# EAGLE design ping_clock_mounting_pcb (EAGLE 6.4)
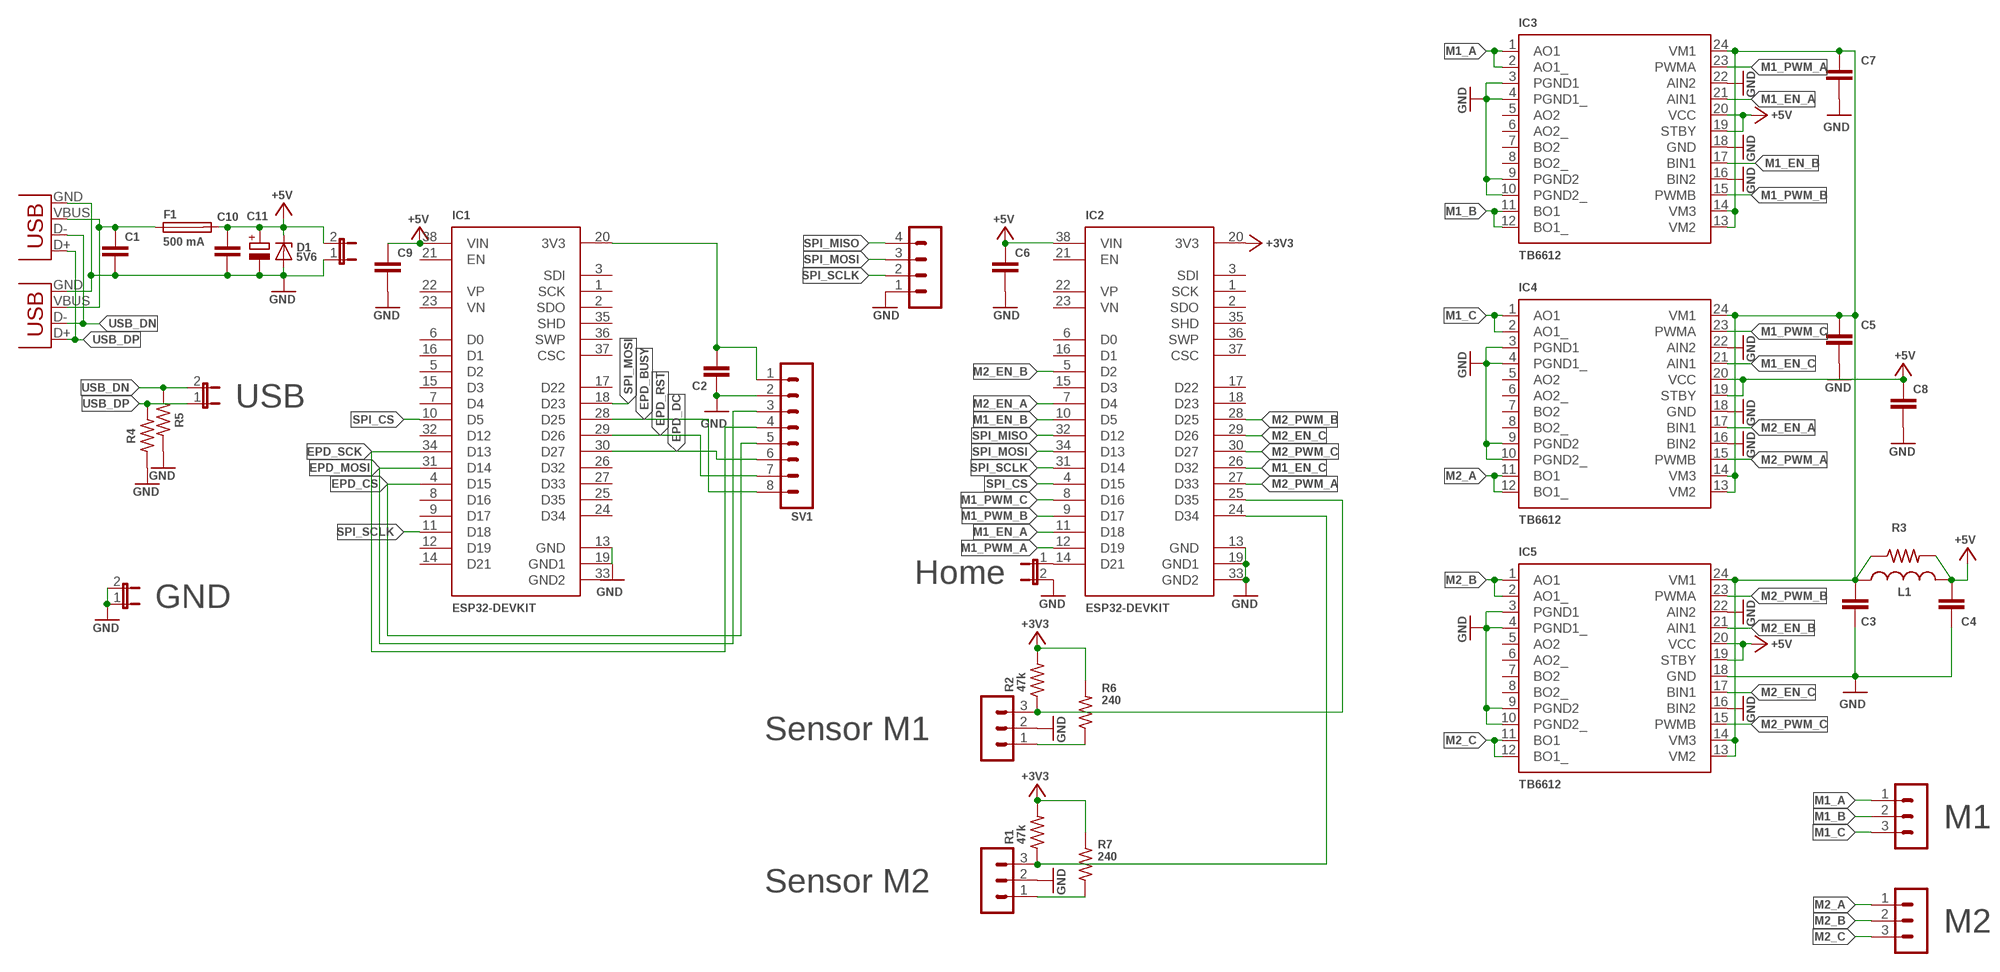
[diagram p0: schematic, sheet 1]

## Parts
C1  C-EUC1206  [C1206]
C2  C-EUC1206  [C1206]
C3  C-EUC1206  [C1206]
C4  C-EUC1206  [C1206]
C5  C-EUC1206  [C1206]
C6  C-EUC1206  [C1206]
C7  C-EUC1206  [C1206]
C8  C-EUC1206  [C1206]
C9  C-EUC1206  [C1206]
C10  C-EUC1206  [C1206]
C11  CPOL-EUD/7343-31R  [D/7343-31R]
D1  5V6  ZENER-DIODEDO41Z10  [DO41Z10]
F1  500 mA  FUSESHK20L  [SHK20L]
IC1  ESP32-DEVKIT  ESP32-DEVKIT-V1  [MODULE_ESP32_DEVKIT_V1]
IC2  ESP32-DEVKIT  ESP32-DEVKIT-V1  [MODULE_ESP32_DEVKIT_V1]
IC3  TB6612  [SSOP24]
IC4  TB6612  [SSOP24]
IC5  TB6612  [SSOP24]
JP1  JP1E  [JP1]
JP3  JP1E  [JP1]
JP4  JP1E  [JP1]
JP5  JP1E  [JP1]
L1  L-USL3225P  [L3225P]
R1  47k  R-US_R1206  [R1206]
R2  47k  R-US_R1206  [R1206]
R3  R-US_R1206  [R1206]
R4  R-US_R1206  [R1206]
R5  R-US_R1206  [R1206]
R6  240  R-US_R1206  [R1206]
R7  240  R-US_R1206  [R1206]
SV1  MA08-1  [MA08-1]
SV2  MA03-1  [MA03-1]
SV3  MA03-1  [MA03-1]
SV4  MA03-1  [MA03-1]
SV5  MA03-1  [MA03-1]
SV6  MA04-1  [MA04-1]
X1  USBSMD  [USB-MINIB]
X2  USBPTH  [USB-B-PTH]

## Nets
+3V3: IC2.20(3V3) R1.2 R2.2 R6.2 R7.2
+5V: C4.1 C6.1 C8.1 C9.1 C10.1 C11.+ D1.C F1.2A IC1.38(VIN) IC2.38(VIN) IC3.19(STBY) IC3.20(VCC) IC4.19(STBY) IC4.20(VCC) IC5.19(STBY) IC5.20(VCC) JP5.2 L1.2 R3.2
EPD_BUSY: IC1.28(D25) SV1.8
EPD_CS: IC1.4(D15) SV1.5
EPD_DC: IC1.30(D27) SV1.6
EPD_MOSI: IC1.31(D14) SV1.3
EPD_RST: IC1.29(D26) SV1.7
EPD_SCK: IC1.34(D13) SV1.4
GND: C1.2 C2.1 C3.2 C4.2 C5.2 C6.2 C7.2 C8.2 C9.2 C10.2 C11.- D1.A IC1.13(GND) IC2.13(GND) IC2.19(GND1) IC2.33(GND2) IC3.3(PGND1) IC3.4(PGND1_) IC3.9(PGND2) IC3.10(PGND2_) IC3.16(BIN2) IC3.18(GND) IC3.22(AIN2) IC4.3(PGND1) IC4.4(PGND1_) IC4.9(PGND2) IC4.10(PGND2_) IC4.16(BIN2) IC4.18(GND) IC4.22(AIN2) IC5.3(PGND1) IC5.4(PGND1_) IC5.9(PGND2) IC5.10(PGND2_) IC5.16(BIN2) IC5.18(GND) IC5.22(AIN2) JP1.1 JP1.2 JP4.2 JP5.1 R4.1 R5.1 SV1.2 SV4.2 SV5.2 SV6.1 X1.GND X2.GND
M1_A: IC3.1(AO1) IC3.2(AO1_) SV2.1
M1_B: IC3.11(BO1) IC3.12(BO1_) SV2.2
M1_C: IC4.1(AO1) IC4.2(AO1_) SV2.3
M1_EN_A: IC2.11(D18) IC3.21(AIN1)
M1_EN_B: IC2.10(D5) IC3.17(BIN1)
M1_EN_C: IC2.26(D32) IC4.21(AIN1)
M1_PWM_A: IC2.12(D19) IC3.23(PWMA)
M1_PWM_B: IC2.9(D17) IC3.15(PWMB)
M1_PWM_C: IC2.8(D16) IC4.23(PWMA)
M2_A: IC4.11(BO1) IC4.12(BO1_) SV3.1
M2_B: IC5.1(AO1) IC5.2(AO1_) SV3.2
M2_C: IC5.11(BO1) IC5.12(BO1_) SV3.3
M2_EN_A: IC2.7(D4) IC4.17(BIN1)
M2_EN_B: IC2.5(D2) IC5.21(AIN1)
M2_EN_C: IC2.29(D26) IC5.17(BIN1)
M2_PWM_A: IC2.27(D33) IC4.15(PWMB)
M2_PWM_B: IC2.28(D25) IC5.23(PWMA)
M2_PWM_C: IC2.30(D27) IC5.15(PWMB)
N$1: IC2.14(D21) JP4.1
N$2: C2.2 IC1.20(3V3) SV1.1
N$3: C1.1 F1.1A X1.VBUS X2.VBUS
N$4: R6.1 SV4.1
N$5: IC2.24(D34) R1.1 SV5.3
N$6: R7.1 SV5.1
N$8: IC2.25(D35) R2.1 SV4.3
N$11: C3.1 C5.1 C7.1 IC3.13(VM2) IC3.14(VM3) IC3.24(VM1) IC4.13(VM2) IC4.14(VM3) IC4.24(VM1) IC5.13(VM2) IC5.14(VM3) IC5.24(VM1) L1.1 R3.1
SPI_CS: IC1.10(D5) IC2.4(D15)
SPI_MISO: IC2.32(D12) SV6.4
SPI_MOSI: IC1.18(D23) IC2.34(D13) SV6.3
SPI_SCLK: IC1.11(D18) IC2.31(D14) SV6.2
USB_DN: JP3.2 R5.2 X1.D- X2.D-
USB_DP: JP3.1 R4.2 X1.D+ X2.D+
Unconnected: IC1.1(SCK) IC1.2(SDO) IC1.3(SDI) IC1.5(D2) IC1.6(D0) IC1.7(D4) IC1.8(D16) IC1.9(D17) IC1.12(D19) IC1.14(D21) IC1.15(D3) IC1.16(D1) IC1.17(D22) IC1.21(EN) IC1.22(VP) IC1.23(VN) IC1.24(D34) IC1.25(D35) IC1.26(D32) IC1.27(D33) IC1.32(D12) IC1.35(SHD) IC1.36(SWP) IC1.37(CSC) IC2.1(SCK) IC2.2(SDO) IC2.3(SDI) IC2.6(D0) IC2.15(D3) IC2.16(D1) IC2.17(D22) IC2.18(D23) IC2.21(EN) IC2.22(VP) IC2.23(VN) IC2.35(SHD) IC2.36(SWP) IC2.37(CSC) IC3.5(AO2) IC3.6(AO2_) IC3.7(BO2) IC3.8(BO2_) IC4.5(AO2) IC4.6(AO2_) IC4.7(BO2) IC4.8(BO2_) IC5.5(AO2) IC5.6(AO2_) IC5.7(BO2) IC5.8(BO2_)

## Notes on the sheet
- USB
- Home
- GND
- Sensor M1
- M1
- Sensor M2
- M2

## Power pins joined to a net without a drawn wire
GND1: IC1.19(GND1)
GND2: IC1.33(GND2)

## Library data of the parts
C1-C10 = rcl:C-EU: CAPACITOR, European symbol
C11 = rcl:CPOL-EU: POLARIZED CAPACITOR, European symbol
D1 = diode:ZENER-DIODE: Z-Diode
F1 = fuse:FUSE: Fuse; OC_FARNELL: unknown; OC_NEWARK: unknown
IC1 IC2 = ESP32-DEVKIT-V1:ESP32-DEVKIT-V1: Dual core, Wi-Fi: 2.4 GHz up to 150 Mbits/s,BLE (Bluetooth Low Energy) and legacy Bluetooth, 32 bits, Up to 240 MHz Check prices <https://pricing.snapeda.com/parts/ESP32-DEVKIT-V1/Do%20it/view-part?ref=eda>; AVAILABILITY: Not in stock; DESCRIPTION: Dual core, Wi-Fi: 2.4 GHz up to 150 Mbits/s,BLE (Bluetooth Low Energy) and legacy Bluetooth, 32 bits, Up to 240 MHz; MF: Do it; MP: ESP32-DEVKIT-V1; PACKAGE: None; PRICE: None
IC3-IC5 = TB6612:TB6612: 8-bit Microcontroller with Multiprotocol Smart Card Interface Source: Uploaded by Heiko Künzel <heiko.kuenzel@atg-gera.de> from ATG Automatisierungstechnik Gera Mon Mar 10 13:32:48 2003 Atmel-Library mit zusätzlich T83C5121-Prozessor im SSOP24-Package.; OC_FARNELL: unknown; OC_NEWARK: unknown
JP1 JP3-JP5 = jumper:JP1E: JUMPER
L1 = rcl:L-US: INDUCTOR, American symbol
R1-R7 = rcl:R-US_: RESISTOR, American symbol
SV1 = con-lstb:MA08-1: PIN HEADER; OC_FARNELL: unknown; OC_NEWARK: unknown
SV2-SV5 = con-lstb:MA03-1: PIN HEADER; OC_FARNELL: unknown; OC_NEWARK: unknown
SV6 = con-lstb:MA04-1: PIN HEADER; OC_FARNELL: unknown; OC_NEWARK: unknown
X1 X2 = SparkFun:USB: USB Connectors USB-B-PTH is fully proven SKU : PRT-00139 USB-miniB is fully proven SKU : PRT-00587 USB-A-PCB is untested. USB-A-H is throughly reviewed, but untested. Spark Fun Electronics SKU : PRT-00437 USB-B-SMT is throughly reviewed, but untested. Needs silkscreen touching up. USB-A-S has not been used/tested USB-MB-H has not been used/tested

## Board
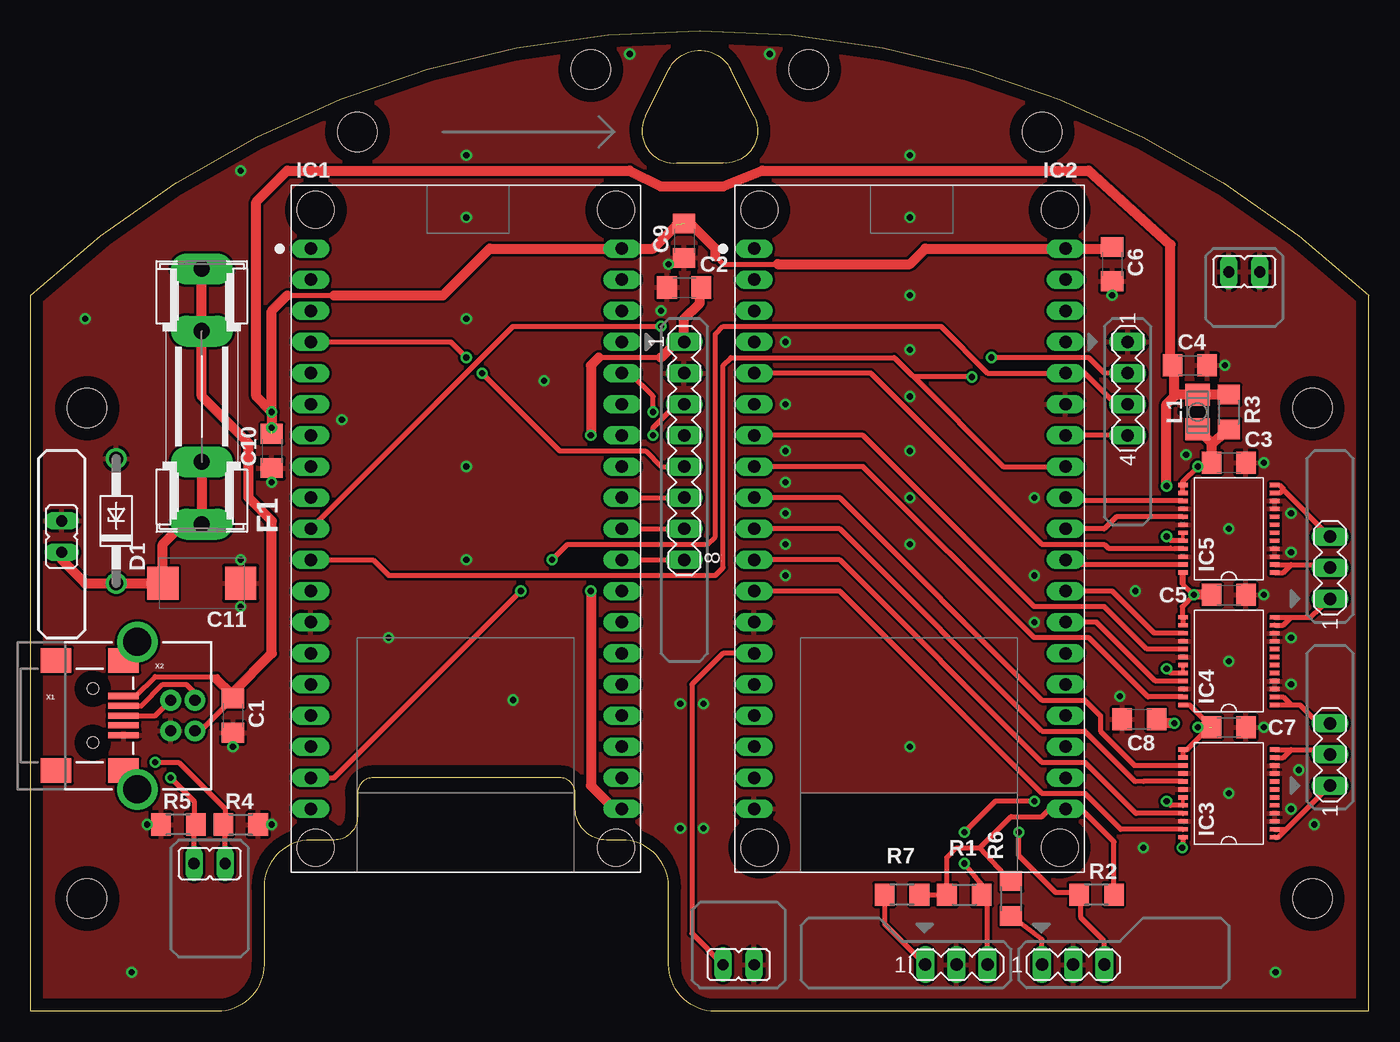
[diagram p1: board, top side]
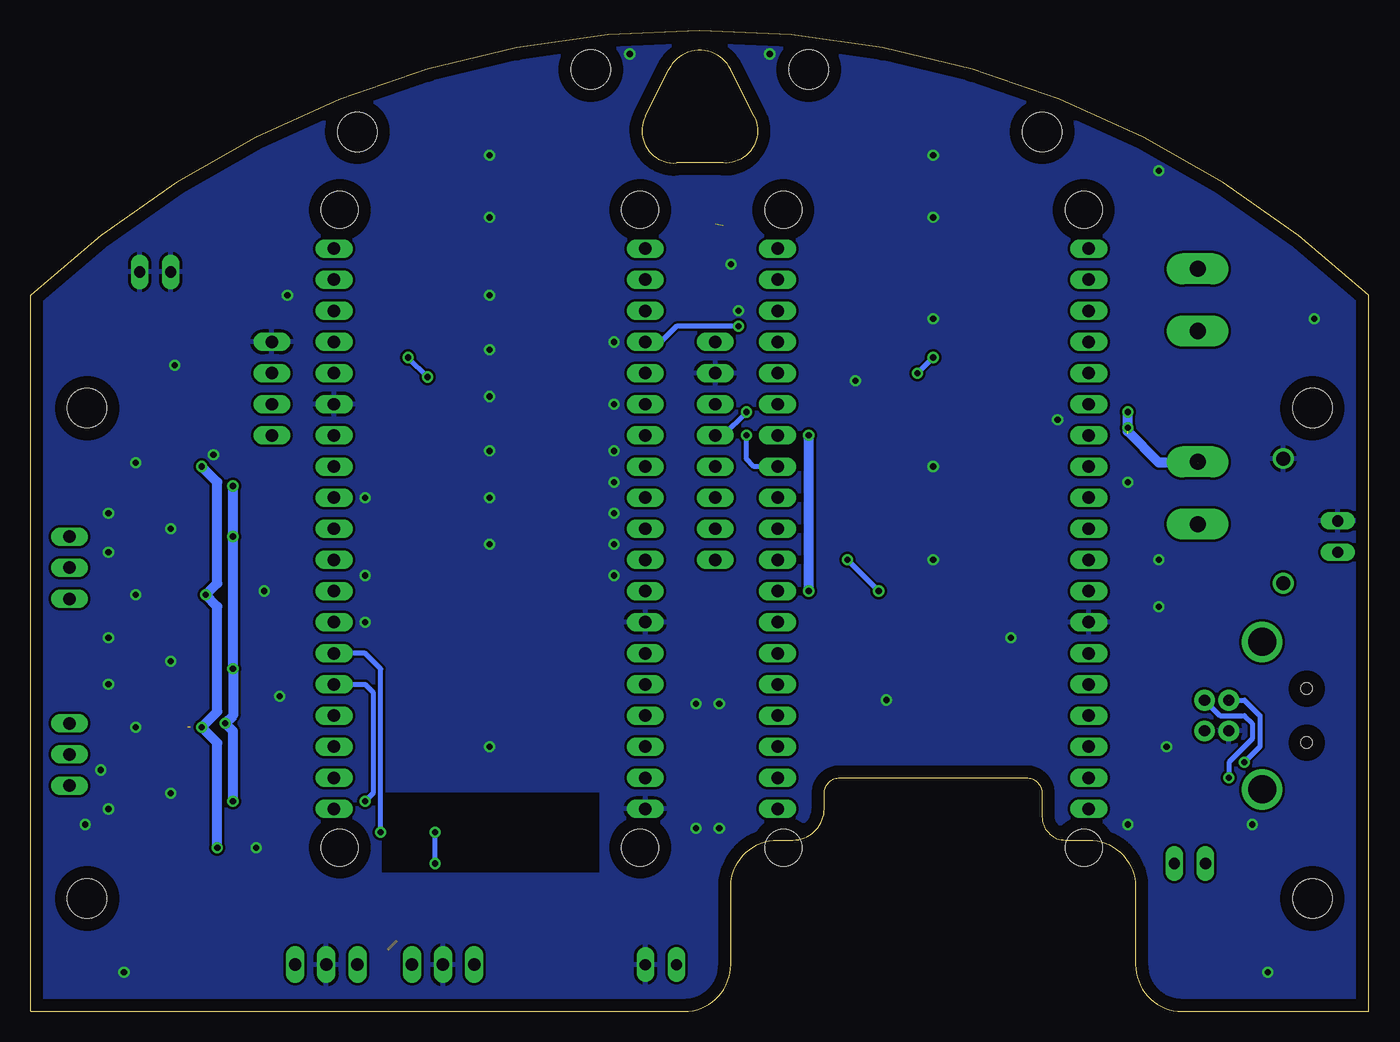
[diagram p2: board, bottom side, seen from below]

Size 109.22 x 80.01 mm. Coordinates in mm from the lower left corner, seen from the top.
Outline: 109.22,0 55.88,0 arc-90 52.07,3.81 52.07,10.16 arc90 48.26,13.97 46.99,13.97 arc-90 44.45,16.51 44.45,17.78 arc90 43.18,19.05 27.94,19.05 arc90 26.67,17.78 26.67,15.88 arc-90 24.77,13.97 22.86,13.97 arc90 19.05,10.16 19.05,3.81 arc-90 15.24,0 0,0 0,58.42 arc-86 109.22,58.42 109.22,0
Outline: 50.16,73.03 arc121 52.7,69.22 56.52,69.22 arc121 59.05,73.03 57.15,76.84 arc127 52.07,76.84 50.16,73.03
Copper layers (1*16): Top 0.035mm / dielectric 1.5mm / Bottom 0.035mm
Design rules "default": minimum track width 10mil, minimum drill 24mil, track to track 8mil, track to pad 8mil, pad to pad 8mil, via to via 8mil, smd to smd 8mil, copper to edge 40mil, drill to drill 8mil, minimum pad ring 10mil, minimum via ring 8mil, stop-mask expansion 4mil, vias tented up to drill 0mil, thermal gap 10mil
Holes 3.2 mm at 4.61,49.21 104.61,9.21 104.61,49.21 4.61,9.21 26.67,71.75 82.55,71.75 45.72,76.84 63.5,76.84
tRestrict: 1 lines

### Footprints (pad centres in the part's own frame; a part is rotated, then mirrored left to right if it is on the bottom)
C1206 = smd 1.6 x 1.8: 1 -1.4,0; 2 1.4,0
D/7343-31R = smd 2.55 x 2.7: + 3.175,0; - -3.175,0
DO41Z10 = drill 1.118: A 5.08,0; C -5.08,0
SHK20L = drill 1.321 pad 2.54 long: 1A -10.414,0; 1B -5.334,0; 2A 10.414,0; 2B 5.334,0
MODULE_ESP32_DEVKIT_V1 = drill 1.016 pad 1.422 long: 1 12.7,-20.32; 2 12.7,-17.78; 3 12.7,-15.24; 4 12.7,-12.7; 5 12.7,-10.16; 6 12.7,-7.62; 7 12.7,-5.08; 8 12.7,-2.54; 9 12.7,0; 10 12.7,2.54; 11 12.7,5.08; 12 12.7,7.62; 13 12.7,10.16; 14 12.7,12.7; 15 12.7,15.24; 16 12.7,17.78; 17 12.7,20.32; 18 12.7,22.86; 19 12.7,25.4; 20 -12.7,25.4; 21 -12.7,22.86; 22 -12.7,20.32; 23 -12.7,17.78; 24 -12.7,15.24; 25 -12.7,12.7; 26 -12.7,10.16; 27 -12.7,7.62; 28 -12.7,5.08; 29 -12.7,2.54; 30 -12.7,0; 31 -12.7,-2.54; 32 -12.7,-5.08; 33 -12.7,-7.62; 34 -12.7,-10.16; 35 -12.7,-12.7; 36 -12.7,-15.24; 37 -12.7,-17.78; 38 -12.7,-20.32 | hole 3: 12.28,28.555; -12.23,28.555; -12.23,-23.475; 12.28,-23.475
SSOP24 = smd 0.35 x 0.8: 1 -3.575,-3.735; 2 -2.925,-3.735; 3 -2.275,-3.735; 4 -1.625,-3.735; 5 -0.975,-3.735; 6 -0.325,-3.735; 7 0.325,-3.735; 8 0.975,-3.735; 9 1.625,-3.735; 10 2.275,-3.735; 11 2.925,-3.735; 12 3.575,-3.735; 13 3.575,3.735; 14 2.925,3.735; 15 2.275,3.735; 16 1.625,3.735; 17 0.975,3.735; 18 0.325,3.735; 19 -0.325,3.735; 20 -0.975,3.735; 21 -1.625,3.735; 22 -2.275,3.735; 23 -2.925,3.735; 24 -3.575,3.735
JP1 = drill 0.914 long: 1 0,-1.27; 2 0,1.27
L3225P = smd 1.8 x 2: 1 -1.4,0; 2 1.4,0
R1206 = smd 1.6 x 1.803: 1 -1.422,0; 2 1.422,0
MA08-1 = drill 1.016 long: 1 -8.89,0; 2 -6.35,0; 3 -3.81,0; 4 -1.27,0; 5 1.27,0; 6 3.81,0; 7 6.35,0; 8 8.89,0
MA03-1 = drill 1.016 long: 1 -2.54,0; 2 0,0; 3 2.54,0
MA04-1 = drill 1.016 long: 1 -3.81,0; 2 -1.27,0; 3 1.27,0; 4 3.81,0
USB-MINIB = smd 2.5 x 0.5: D+ 2.5,0; D- 2.5,0.8; GND 2.5,-1.6; ID 2.5,-0.8; VBUS 2.5,1.6 | smd 2.5 x 2: GND@1 -3,-4.5; GND@2 -3,4.5; GND@3 2.5,4.5; GND@4 2.5,-4.5 | hole 0.9: 0,2.2; 0,-2.2
USB-B-PTH = drill 0.914 pad 1.676: D+ 0,1.25; D- 1.981,1.25; GND 0,-1.25; VBUS 1.981,-1.25 | drill 2.286: P$1 -2.718,-6.02; P$2 -2.718,6.02

### Placement (x,y rotation side)
C1  16.51,24.13 270 top
C2  53.34,59.05 0 top
C3  97.79,44.77 0 top
C4  94.62,52.7 0 top
C5  97.79,33.97 0 top
C6  88.27,60.96 270 top
C7  97.79,23.18 0 top
C8  90.49,23.81 180 top
C9  53.34,62.87 270 top
C10  19.69,45.72 270 top
C11  13.97,34.92 180 top
D1  6.98,40.01 90 top
F1  13.97,50.16 270 top
IC1  35.56,41.91 180 top
IC2  71.75,41.91 180 top
IC3  97.79,17.78 90 top
IC4  97.79,28.57 90 top
IC5  97.79,39.37 90 top
JP1  99.06,60.33 270 top
JP3  14.6,12.07 90 top
JP4  57.78,3.81 270 top
JP5  2.54,38.73 180 top
L1  95.25,48.89 90 top
R1  76.2,9.53 180 top
R2  87,9.53 0 top
R3  97.79,48.89 90 top
R4  17.14,15.24 180 top
R5  12.06,15.24 0 top
R6  80.01,9.21 90 top
R7  71.12,9.53 0 top
SV1  53.34,45.72 270 top
SV2  106.05,20.95 90 top
SV3  106.05,36.2 90 top
SV4  85.09,3.81 0 top
SV5  75.56,3.81 0 top
SV6  89.53,50.8 270 top
X1  5.08,24.13 0 top
X2  11.43,24.13 0 top

### Tracks (layer width: path | path; a pad name or v marks a point on that pad's centre or on a via)
+3V3
  Top 0.406: R6.2 77.47,13.34 | 77.47,13.34 80.01,15.88 82.55,15.88 83.19,16.51 IC2.20 85.72,16.51 88.42,13.82 R2.2 | R7.2 R1.2 74.78,12.55 75.56,13.34 77.47,13.34
+5V  (via drill 0.5)  (3 unrouted)
  Top 0.305: IC5.20 IC5.19 | IC4.19 IC4.20 | IC3.19 IC3.20
  Top 0.406: IC4.20 93.05,27.6 v92.71,27.94 | 92.2,23.5 C8.1 | IC5.20 93.05,38.4 v92.71,38.73 | IC3.20 93.05,16.8 v92.71,17.15 | 20.95,58.42 24.77,58.42 | 55.88,61.59 56.52,60.96 60.96,60.96
  Top 0.813: v93.34,23.5 92.2,23.5 | 13.97,44.77 F1.2A 13.72,40.01 12.7,40.01 10.8,38.1 C11.+ D1.C 4.45,34.92 2.54,36.83 JP5.2 | v19.69,48.89 v19.69,47.62 | C6.1 88.13,62.23 IC2.38 73.03,62.23 71.75,60.96 60.96,60.96 | 24.77,58.42 33.66,58.42 37.47,62.23 IC1.38 50.8,62.23 52.7,64.13 | v19.69,48.89 18.41,50.16 18.41,66.04 20.95,68.58 48.89,68.58 51.44,67.31 56.52,67.31 59.69,68.58 86.36,68.58 93.03,62.55 93.03,52.7 C4.1 93.34,52.58 93.34,50.16 | v19.69,48.89 19.69,57.15 20.95,58.42 | 55.88,61.59 55.88,62.23 53.98,64.13 53.47,64.13 C9.1 | v92.71,42.86 92.71,49.53 93.34,50.16 | 93.34,50.16 93.47,50.3 L1.2 95.27,50.32 R3.2
  Bottom 0.813: 13.97,44.77 17.14,44.77 19.69,47.31 v19.69,48.89 | v92.71,42.86 v92.71,38.73 v92.71,27.94 92.71,24.13 v93.34,23.5 92.71,22.86 v92.71,17.15
EPD_BUSY
  Top 0.406: IC1.28 SV1.8
EPD_CS  (via drill 0.5)
  Top 0.406: IC1.4 34.29,54.61 v35.56,53.34 | v36.83,52.07 43.18,45.72 50.16,45.72 51.44,44.45 SV1.5
  Bottom 0.406: v35.56,53.34 v36.83,52.07
EPD_DC
  Top 0.406: IC1.30 SV1.6
EPD_MOSI  (via drill 0.5)
  Top 0.406: v50.8,46.99 50.8,47.62 52.7,49.53 SV1.3
  Bottom 0.406: IC1.31 50.16,44.45 50.8,45.09 v50.8,46.99
EPD_RST
  Top 0.406: IC1.29 SV1.7
EPD_SCK  (via drill 0.5)
  Top 0.406: v50.8,48.89 50.8,50.16 48.89,52.07 IC1.34
  Bottom 0.406: SV1.4 52.7,46.99 v50.8,48.89
GND  (via drill 0.5)
  other vias: 53.02,25.08 54.93,25.08 53.02,14.92 54.93,14.92 88.9,25.72 88.27,58.42 103.5,19.69 102.87,16.51 102.87,26.67 102.87,30.48 100.65,23.18 100.65,33.97 102.87,37.47 102.87,40.64 97.79,28.57 97.79,17.78 97.79,39.37 100.65,44.77 104.78,15.24 90.81,13.34 101.6,3.18 60.33,78.11 48.89,78.11 4.45,56.52 17.14,33.02 8.26,3.18 39.37,25.4 35.56,44.45 25.4,48.26 35.56,56.52 71.75,58.42 71.75,38.1 71.75,50.16 61.59,54.61 61.59,35.56 61.59,43.18 81.91,41.91 51.44,57.15 52.07,60.96 94.3,45.4 61.59,49.53 81.91,35.56 71.75,45.72 61.59,38.1 61.59,40.64 90.17,34.29 61.59,45.72 81.91,31.75 71.75,41.91 71.75,53.98 71.75,21.59 35.56,64.77 17.14,68.58 71.75,64.77 35.56,36.83 41.91,51.44 29.21,30.48 16.51,21.59 9.52,15.24 19.69,15.24 19.69,43.18 17.14,36.83 35.56,69.85 71.75,69.85 97.47,52.7
  pour Bottom: -3.81,81.28 -3.81,-3.81 111.76,-3.81 111.76,81.28
  pour Top: 0,81.28 0,-3.81 115.57,-3.81 115.57,81.28
M1_A
  Top 0.406: IC3.2 102.48,14.86 | 102.48,14.86 105.41,17.78 105.41,18.22 SV2.1 | IC3.1 101.84,14.21 102.48,14.86
M1_B
  Top 0.406: IC3.12 102.87,21.36 | 102.87,21.36 105.38,21.36 SV2.2 | IC3.11 102.22,20.7 102.87,21.36
M1_C
  Top 0.406: IC4.1 102.87,25 | IC4.2 102.22,25.65 102.87,25 | 102.87,25 103.59,25 104.78,23.81 105.47,23.81 SV2.3
M1_EN_A
  Top 0.406: IC3.21 90.21,16.16 86.04,20.32 82.55,20.32 66.04,36.83 IC2.11
M1_EN_B
  Top 0.406: IC3.17 90.83,18.76 90.17,18.73 86.04,22.86 82.55,22.86 66.04,39.37 IC2.10
M1_EN_C
  Top 0.406: IC4.21 91.8,26.95 87,31.75 IC2.26
M1_PWM_A
  Top 0.406: IC3.23 88.97,14.86 86.04,17.78 82.55,17.78 66.04,34.29 IC2.12
M1_PWM_B
  Top 0.406: IC3.15 90.12,20.05 87.31,22.86 87.31,24.13 86.04,25.4 82.55,25.4 66.04,41.91 IC2.9
M1_PWM_C
  Top 0.406: IC4.23 91.19,25.65 86.36,30.48 81.91,30.48 67.94,44.45 IC2.8
M2_A
  Top 0.406: IC4.12 102.87,32.15 | 102.87,32.15 104.42,32.15 SV3.1 | IC4.11 102.22,31.5 102.87,32.15
M2_B
  Top 0.406: IC5.2 102.87,36.45 | 102.87,36.45 105.54,36.45 SV3.2 | IC5.1 102.22,35.8 102.87,36.45
M2_C
  Top 0.406: IC5.12 101.89,42.95 102.27,42.58 | 102.27,42.58 102.27,42.52 SV3.3 | IC5.11 101.98,42.3 102.27,42.58
M2_EN_A
  Top 0.406: IC4.17 91.1,29.55 87.63,33.02 81.91,33.02 67.94,46.99 IC2.7
M2_EN_B
  Top 0.406: IC5.21 93.38,37.75 93.03,37.78 87.95,37.78 87.63,38.1 87.31,38.1 82.55,38.1 68.58,52.07 IC2.5
M2_EN_C
  Top 0.406: IC5.17 88.6,40.34 87.63,39.37 IC2.29
M2_PWM_A
  Top 0.406: IC4.15 91.7,30.85 88.27,34.29 IC2.27
M2_PWM_B
  Top 0.406: IC5.23 84.84,36.45 IC2.28
M2_PWM_C
  Top 0.406: IC5.15 84.72,41.65 IC2.30
N$1
  Top 0.406: IC2.14 56.52,29.21 53.98,26.67 53.98,6.35 JP4.1
N$2  (via drill 0.5)
  Top 0.406: 51.44,53.34 46.35,53.34
  Top 0.813: 51.44,53.34 52.7,54.61 SV1.1 53.34,56.52 54.61,57.78 54.61,58.92 C2.2 | 46.35,53.34 45.72,52.7 v45.72,46.99 | v45.72,34.29 45.72,18.41 47.62,16.51 IC1.20
  Bottom 0.813: v45.72,46.99 v45.72,34.29
N$3
  Top 0.406: X1.VBUS 8.59,25.73 10.16,27.3 14.73,27.3 | 14.73,27.3 C1.1 13.86,22.88 X2.VBUS | 14.73,27.3 15.24,27.3 16.51,26.04
  Top 0.813: 16.51,26.04 19.69,29.21 19.69,40.01 17.78,41.91 17.78,46.36 13.97,50.16 F1.1A
N$4
  Top 0.406: SV4.1 82.55,5.88 R6.1
N$5  (via drill 0.5)
  Top 0.406: v76.2,12.07 77.62,10.31 R1.1 78.11,9.04 SV5.3 | v81.91,17.15 78.74,17.15 v76.2,14.61
  Bottom 0.406: v76.2,12.07 v76.2,14.61 | IC2.24 81.91,26.67 81.28,26.04 81.28,17.78 v81.91,17.15
N$6
  Top 0.406: R7.1 69.7,7.14 SV5.1
N$8  (via drill 0.5)
  Top 0.406: v80.64,14.61 80.64,12.7 83.67,9.68 85.57,9.68 R2.1 85.72,9.37 85.72,7.62 87.63,5.71 SV4.3
  Bottom 0.406: v80.64,14.61 80.64,27.94 81.91,29.21 IC2.25
N$11  (via drill 0.5)  (1 unrouted)
  Top 0.406: IC4.24 94.57,25 C7.1 96.07,22.86 95.88,22.86 94.38,21.36 IC3.13 IC3.14 | IC4.14 IC4.13 93.98,32.23 93.98,33.02 v94.93,33.97 94.06,34.85 | 94.06,34.85 93.98,34.92 93.98,35.72 IC5.24 94.06,34.85 | C3.1 96.07,44.45 v95.25,44.45 94.06,43.26 IC5.13 IC5.14 | IC3.24 94.06,13.41 v93.98,13.34
  Top 0.813: C5.1 v94.93,33.97 | C3.1 96.39,46.33 | 96.39,46.33 R3.1 | 96.2,23.18 v95.25,23.18 | 96.39,46.33 96.39,46.36 L1.1
  Bottom 0.813: v95.25,44.45 93.98,43.18 93.98,34.92 v94.93,33.97 93.98,33.02 93.98,24.45 v95.25,23.18 93.98,21.91 v93.98,13.34
SPI_CS  (via drill 0.5)
  Top 0.406: IC1.10 39.37,55.88 v51.44,55.88
  Bottom 0.406: v51.44,55.88 56.52,55.88 57.78,54.61 IC2.4
SPI_MISO
  Top 0.406: SV6.4 IC2.32
SPI_MOSI  (via drill 0.5)
  Top 0.406: IC1.18 24.77,19.05 v40,34.29 | v42.55,36.83 43.81,38.1 55.24,38.1 55.88,38.73 55.88,55.25 56.52,55.88 74.3,55.88 78.11,52.07 IC2.34 86.04,52.07 88.58,49.53 SV6.3
  Bottom 0.406: v40,34.29 v42.55,36.83
SPI_SCLK  (via drill 0.5)
  Top 0.406: IC1.11 27.94,36.83 29.21,35.56 55.88,35.56 56.52,36.2 56.52,52.7 57.15,53.34 70.48,53.34 71.91,51.91 72.07,51.75 | 72.07,51.75 79.38,44.45 IC2.31 | SV6.2 87.63,52.07 86.36,53.34 v78.42,53.34 | v76.84,51.75 72.07,51.75
  Bottom 0.406: v78.42,53.34 v76.84,51.75
USB_DN  (via drill 0.5)
  Top 0.406: X1.D- 9.05,24.93 10.8,26.67 12.7,26.67 13.34,26.04 13.34,25.46 X2.D- | v11.43,19.05 13.34,17.15 13.34,15.39 R5.2 13.34,15.09 JP3.2
  Bottom 0.406: X2.D- 12.16,24.13 10.16,24.13 9.52,23.5 9.52,22.23 11.43,20.32 v11.43,19.05
USB_DP  (via drill 0.5)  (1 unrouted)
  Top 0.406: X1.D+ 10.18,24.13 | 10.18,24.13 10.8,24.76 X2.D+ 11.43,25.4 10.18,24.15 10.18,24.13 | v10.16,20.32 12.06,20.32 15.88,16.51 15.88,15.39 R4.2 15.88,15.09 JP3.1
  Bottom 0.406: v10.16,20.32 8.89,21.59 8.89,24.13 10.16,25.4 11.43,25.4

### Text on the board
tDocu: MOUNTING | GND | GND | M2 | SPI | VUSB | EPD | M1 | DN | DP | HOME | USB | M2 | M1 | SENS | SENS